# EAGLE schematic Main (EAGLE 7.7.0)
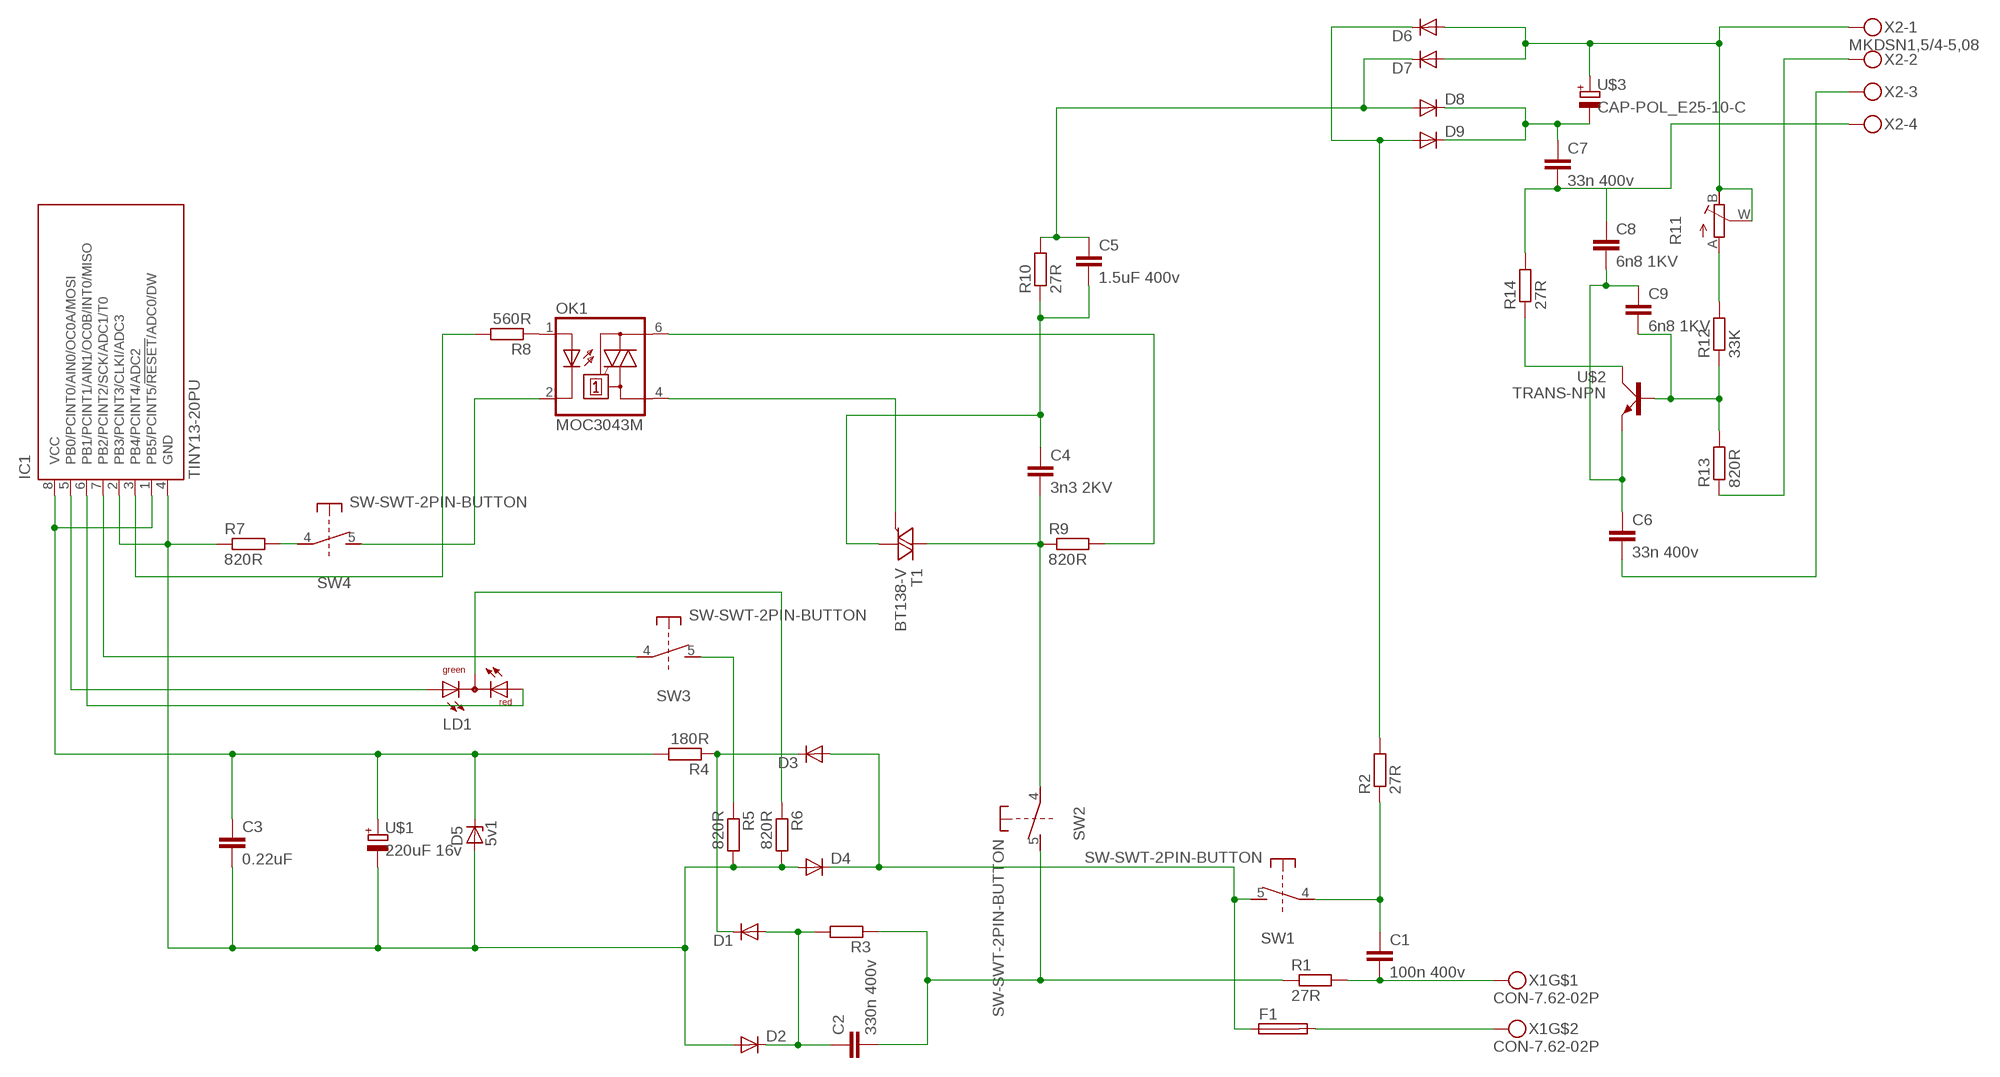
[diagram p0: schematic, sheet 1]

## Parts
C1  100n 400v  C-EU375-155X418  [C375-155X418]
C2  330n 400v  C-EU375-155X418  [C375-155X418]
C3  0.22uF  CAP_C50-024X044  [C050-024X044]
C4  3n3 2KV  CAP_C50-024X044  [C050-024X044]
C5  1.5uF 400v  C-EU375-155X418  [C375-155X418]
C6  33n 400v  C-EU375-155X418  [C375-155X418]
C7  33n 400v  C-EU375-155X418  [C375-155X418]
C8  6n8 1KV  CAP_C50-024X044  [C050-024X044]
C9  6n8 1KV  CAP_C50-024X044  [C050-024X044]
D1  DIODE_DO-201  [DO201-15]
D2  DIODE_DO-201  [DO201-15]
D3  DIODE_DO-201  [DO201-15]
D4  DIODE_DO-201  [DO201-15]
D5  5v1  ZENER-DIODEDO35Z10  [DO35Z10]
D6  DIODE_DO-201  [DO201-15]
D7  DIODE_DO-201  [DO201-15]
D8  DIODE_DO-201  [DO201-15]
D9  DIODE_DO-201  [DO201-15]
F1  SH22,5  [SH22,5]
IC1  TINY13-20PU  [DIL08]
LD1  DUOLED-RG-C  [DUOLED-C-5MM]
OK1  MOC3043M  [DIL06]
R1  27R  R_MF-2  [MF-2]
R2  27R  R_MF-2  [MF-2]
R3  R_MF-2  [MF-2]
R4  180R  R_MF-2  [MF-2]
R5  820R  R_MF-2  [MF-2]
R6  820R  R_MF-2  [MF-2]
R7  820R  R_MF-2  [MF-2]
R8  560R  R_MF-2  [MF-2]
R9  820R  R_MF-2  [MF-2]
R10  27R  R_MF-2  [MF-2]
R11  R_POTTURN-X  [RJ9W]
R12  33K  R_MF-2  [MF-2]
R13  820R  R_MF-2  [MF-2]
R14  27R  R_MF-2  [MF-2]
SW1  SW-SWT-2PIN-BUTTON  [SWT-2-2PIN-WBUTTON]
SW2  SW-SWT-2PIN-BUTTON  [SWT-2-2PIN-WBUTTON]
SW3  SW-SWT-2PIN-BUTTON  [SWT-2-2PIN-WBUTTON]
SW4  SW-SWT-2PIN-BUTTON  [SWT-2-2PIN-WBUTTON]
T1  BT138-V  [TO220BV]
U$1  220uF 16v  CAP-POL_E3.5-8  [E3,5-8]
U$2  TRANS-NPN  [SOT-92WIDE]
U$3  CAP-POL_E25-10-C  [C_D25-G10-CLAMP]
X1  CON-7.62-02P  [KF25C-7.62-02P-13]
X2  MKDSN1,5/4-5,08  [MKDSN1,5/4-5,08]

## Nets
N$1: C1.1 R2.1 SW1.4
N$2: C1.2 R1.2 X1.P$1
N$3: F1.2 X1.P$2
N$4: IC1.5(PB0/PCINT0/AIN0/OC0A/MOSI) LD1.AX(AG)
N$5: C2.2 R1.1 R3.1 SW2.5
N$6: C2.1 D1.A D2.C R3.2
N$7: IC1.6(PB1/PCINT1/AIN1/OC0B/INT0/MISO) LD1.AR
N$8: D3.A D4.C F1.1 SW1.5
N$9: C3.2 D2.A D4.A D5.A IC1.2(PB3/PCINT3/CLKI/ADC3) IC1.4(GND) R5.2 R6.2 R7.1 U$1.-
N$10: D1.C D3.C R4.1
N$11: R5.1 SW3.5
N$12: LD1.C R6.1
N$13: C3.1 D5.C IC1.1(PB5/PCINT5/!RESET!/ADC0/DW) IC1.8(VCC) R4.2 U$1.+
N$15: R7.2 SW4.4
N$16: IC1.7(PB2/PCINT2/SCK/ADC1/T0) SW3.4
N$17: OK1.2(C) SW4.5
N$18: IC1.3(PB4/PCINT4/ADC2) R8.2
N$19: OK1.1(A) R8.1
N$20: OK1.4(A1) T1.G
N$21: C4.2 R9.1 SW2.4 T1.T2(A2)
N$22: C4.1 C5.2 R10.1 T1.T1(A1)
N$23: OK1.6(A2) R9.2
N$25: C5.1 D7.C D8.A R10.2
N$26: D6.C D9.A R2.2
N$29: D6.A D7.A R11.B(E) R11.W(S) U$3.+ X2.1
N$30: R11.A R12.2
N$31: C9.2 R12.1 R13.2 U$2.B
N$32: R13.1 X2.2
N$34: C7.1 D8.C D9.C U$3.-
N$35: C6.1 C8.2 C9.1 U$2.E
N$36: C6.2 X2.3
N$37: R14.1 U$2.C
N$38: C7.2 C8.1 R14.2 X2.4

## Library data of the parts
C1 C2 C5-C7 = rcl:C-EU: CAPACITOR, European symbol
C3 C4 C8 C9 = Namenlos:CAP_
D1-D4 D6-D9 = Namenlos:DIODE_
D5 = diode:ZENER-DIODE: Z-Diode
F1 = fuse:SH22,5: FUSE HOLDER grid 22,5 mm, OGN0031 8201, Schurter (Buerklin); MF: SCHURTER; MPN: 0031.8201; OC_FARNELL: 1162740; OC_NEWARK: 96F8317
IC1 = atmel:TINY13: 8-bit AVR Microcontroller with 1K Bytes In-System Programmable Flash Source: http://www.atmel.com/dyn/resources/prod_documents/2535S.pdf; MPN: ATTINY13-20PU; OC_FARNELL: 9171550; OC_NEWARK: 96K6521
LD1 = led:DUOLED-RG-C: DUO LED 2 colors (red/green), 5 mm, round, common Cathode www.ligitek.com or other producers.
OK1 = optocoupler:MOC30*: 6-Pin DIP Zero-Cross Optoisolators Triac Driver Output (250/400 Volt Peak) Source: Data sheet <http://www.fairchildsemi.com/ds/MO/MOC3031M.pdf> The old path of data sheet not more available 2013-05-06.; MF: FAIRCHILD SEMICONDUCTOR; MPN: MOC3043-M; OC_FARNELL: 1021371; OC_NEWARK: 72K8900
R1-R10 R12-R14 = Namenlos:R_
R11 = Namenlos:R_POT
SW1-SW4 = Namenlos:SW-SWT-2PIN-BUTTON
T1 = triac:BT138: TRIAC Source: http://www.semiconductors.philips.com BT138_SERIES_2.pdf
U$1 U$3 = Namenlos:CAP-POL_
U$2 = Namenlos:TRANS-NPN
X1 = Namenlos:CON-7.62-02P
X2 = con-phoenix-508:MKDSN1,5/4-5,08: MKDSN 1,5/ 4-5,08 Printklemme Nennstrom: 13,5 A Nennspannung: 250 V Rastermaß: 5,08 mm Polzahl: 4 Anschlussart: Schraubanschluss Montage: Löten Anschlussrichtung Leiter/Platine: 0 ° Artikelnummer: 1729144 Source: http://eshop.phoenixcontact.com .. 1729144.pdf